# Altium schematic sheet FPGA_PWR.SchDoc
size A4; SheetNumber: 3; SheetTotal: 5
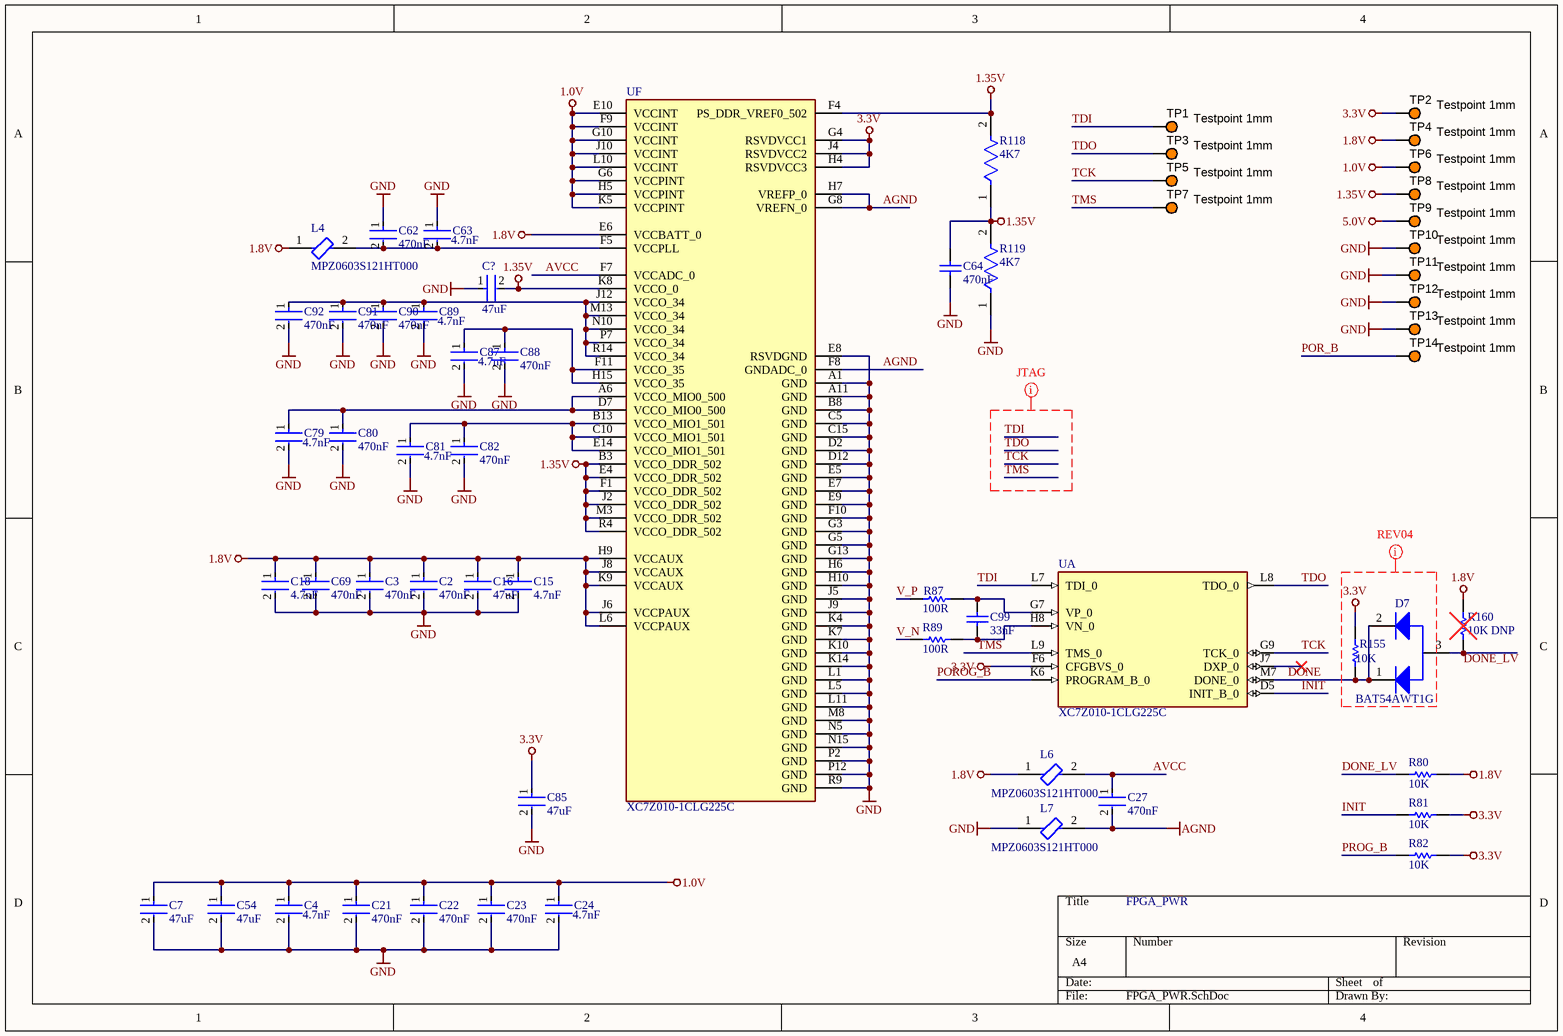
[diagram p0: FPGA_PWR.SchDoc]

## Parts
C2  470nF  [FP-0402-L_1_0_0_05-W_0_5-MFG]
C3  470nF  [FP-0402-L_1_0_0_05-W_0_5-MFG]
C4  4.7nF  [FP-CC0603-DA-MFG]
C7  47uF  [FP-GRM219-0_2-0_1-IPC_A]
C15  4.7nF  [FP-CC0603-DA-MFG]
C16  47uF  [FP-GRM219-0_2-0_1-IPC_A]
C18  4.7nF  [FP-CC0603-DA-MFG]
C21  470nF  [FP-0402-L_1_0_0_05-W_0_5-MFG]
C22  470nF  [FP-0402-L_1_0_0_05-W_0_5-MFG]
C23  470nF  [FP-0402-L_1_0_0_05-W_0_5-MFG]
C24  4.7nF  [FP-CC0603-DA-MFG]
C27  470nF  [FP-0402-L_1_0_0_05-W_0_5-MFG]
C54  47uF  [FP-GRM219-0_2-0_1-IPC_A]
C62  470nF  [FP-0402-L_1_0_0_05-W_0_5-MFG]
C63  4.7nF  [FP-CC0603-DA-MFG]
C64  470nF  [CAPC1005X56X25LL10T15]
C69  470nF  [FP-0402-L_1_0_0_05-W_0_5-MFG]
C79  4.7nF  [FP-CC0603-DA-MFG]
C80  470nF  [FP-0402-L_1_0_0_05-W_0_5-MFG]
C81  4.7nF  [FP-CC0603-DA-MFG]
C82  470nF  [FP-0402-L_1_0_0_05-W_0_5-MFG]
C85  47uF  [FP-GRM219-0_2-0_1-IPC_A]
C87  4.7nF  [FP-CC0603-DA-MFG]
C88  470nF  [FP-0402-L_1_0_0_05-W_0_5-MFG]
C89  4.7nF  [FP-CC0603-DA-MFG]
C90  470nF  [FP-0402-L_1_0_0_05-W_0_5-MFG]
C91  470nF  [FP-0402-L_1_0_0_05-W_0_5-MFG]
C92  470nF  [FP-0402-L_1_0_0_05-W_0_5-MFG]
C99  33nF  [CAPC1608X92X38LL15T08]
C?  47uF  [FP-GRM219-0_2-0_1-IPC_A]
D7  BAT54AWT1G  [ONSC-SOT-323-3-419-04_V]
L4  MPZ0603S121HT000  [FP-MPZ0603-IPC_C]
L6  MPZ0603S121HT000  [FP-MPZ0603-IPC_C]
L7  MPZ0603S121HT000  [FP-MPZ0603-IPC_C]
R80  10K  [RESC1005X40X25LL10T10]
R81  10K  [RESC1005X40X25LL10T10]
R82  10K  [RESC1005X40X25LL10T10]
R87  100R  [RESC0603X28X15LL05T05]
R89  100R  [RESC0603X28X15LL05T05]
R118  4K7  [FP-AC0402-MFG]
R119  4K7  [FP-AC0402-MFG]
R155  10K  [RESC1005X40X25LL10T10]
R160  10K DNP  [RESC1005X40X25LL10T10]
TP1  Testpoint 1mm  [KSTN-5003]
TP2  Testpoint 1mm  [KSTN-5003]
TP3  Testpoint 1mm  [KSTN-5003]
TP4  Testpoint 1mm  [KSTN-5003]
TP5  Testpoint 1mm  [KSTN-5003]
TP6  Testpoint 1mm  [KSTN-5003]
TP7  Testpoint 1mm  [KSTN-5003]
TP8  Testpoint 1mm  [KSTN-5003]
TP9  Testpoint 1mm  [KSTN-5003]
TP10  Testpoint 1mm  [KSTN-5003]
TP11  Testpoint 1mm  [KSTN-5003]
TP12  Testpoint 1mm  [KSTN-5003]
TP13  Testpoint 1mm  [KSTN-5003]
TP14  Testpoint 1mm  [KSTN-5003]
U  XC7Z010-1CLG225C  [BGA225C80P15X15_1300X1300X150]  (parts A,F of 6)

## Nets
1.0V: C4.1 C7.1 C21.1 C22.1 C23.1 C24.1 C54.1 TP6.1 U.E10(VCCINT) U.F9(VCCINT) U.G6(VCCPINT) U.G10(VCCINT) U.H5(VCCPINT) U.J10(VCCINT) U.K5(VCCPINT) U.L10(VCCINT)
1.8V: C2.1 C3.1 C15.1 C16.1 C18.1 C69.1 L4.1 L6.1 R80.2 R160.2 TP4.1 U.E6(VCCBATT_0) U.H9(VCCAUX) U.J6(VCCPAUX) U.J8(VCCAUX) U.K9(VCCAUX) U.L6(VCCPAUX)
1.35V: C64.2 C?.2 R118.1 R118.2 R119.2 TP8.1 U.B3(VCCO_DDR_502) U.E4(VCCO_DDR_502) U.F1(VCCO_DDR_502) U.F4(PS_DDR_VREF0_502) U.J2(VCCO_DDR_502) U.K8(VCCO_0) U.M3(VCCO_DDR_502) U.R4(VCCO_DDR_502)
3.3V: C85.1 R81.2 R82.2 R155.2 TP2.1 U.F6(CFGBVS_0) U.G4(RSVDVCC1) U.H4(RSVDVCC3) U.J4(RSVDVCC2)
5.0V: TP9.1
AGND: C27.2 L7.2 U.F8(GNDADC_0) U.G8(VREFN_0) U.H7(VREFP_0)
GND: C2.2 C3.2 C4.2 C7.2 C15.2 C16.2 C18.2 C21.2 C22.2 C23.2 C24.2 C54.2 C62.1 C63.1 C64.1 C69.2 C79.2 C80.2 C81.2 C82.2 C85.2 C87.2 C88.2 C89.2 C90.2 C91.2 C92.2 C?.1 L7.1 R119.1 TP10.1 TP11.1 TP12.1 TP13.1 U.A1(GND) U.A11(GND) U.B8(GND) U.C5(GND) U.C15(GND) U.D2(GND) U.D12(GND) U.E5(GND) U.E7(GND) U.E8(RSVDGND) U.E9(GND) U.F10(GND) U.G3(GND) U.G5(GND) U.G13(GND) U.H6(GND) U.H10(GND) U.J5(GND) U.J9(GND) U.K4(GND) U.K7(GND) U.K10(GND) U.K14(GND) U.L1(GND) U.L5(GND) U.L11(GND) U.M8(GND) U.N5(GND) U.N15(GND) U.P2(GND) U.P12(GND) U.R9(GND)
AVCC: C27.1 L6.2 U.F7(VCCADC_0)
DONE: D7.1(K1) D7.2(K2) R155.1 U.M7(DONE_0)
DONE_LV: R80.1
INIT: R81.1 U.D5(INIT_B_0)
POR_B: TP14.1
POROG_B: U.K6(PROGRAM_B_0)
PROG_B: R82.1
TCK: TP5.1 U.G9(TCK_0)
TDI: TP1.1 U.L7(TDI_0)
TDO: TP3.1 U.L8(TDO_0)
TMS: TP7.1 U.L9(TMS_0)
V_N: R89.1
V_P: R87.1
NetC62_2: C62.2 C63.2 L4.2 U.F5(VCCPLL)
NetC79_1: C79.1 C80.1 U.A6(VCCO_MIO0_500) U.D7(VCCO_MIO0_500)
NetC81_1: C81.1 C82.1 U.B13(VCCO_MIO1_501) U.C10(VCCO_MIO1_501) U.E14(VCCO_MIO1_501)
NetC87_1: C87.1 C88.1 U.F11(VCCO_35) U.H15(VCCO_35)
NetC89_1: C89.1 C90.1 C91.1 C92.1 U.J12(VCCO_34) U.M13(VCCO_34) U.N10(VCCO_34) U.P7(VCCO_34) U.R14(VCCO_34)
NetC99_1: C99.1 R89.2 U.H8(VN_0)
NetC99_2: C99.2 R87.2 U.G7(VP_0)
NetD7_3: D7.3(A) R160.1

Not connected (* = marked no-connect by the designer): U J7(DXP_0)*

## Layout directives
mark named REV04: 3.3V
mark named JTAG: TCK, TDI, TDO, TMS

## Notes on the sheet
- FPGA_PWR
- Labels drawn without touching a wire or pin: DONE_LV

## Library data of the parts
C2 C3 C21-C23 C27 C62 C69 C80 C82 C88 C90-C92 = CMP-14477-002186-2: None; Tolerance: 20%; Voltage Rating: 6.3V; Capacitance: 470nF; Case Code (Imperial): 0402; Mount: Surface Mount; Packaging: Tape and Reel; Width: 0.02inch; Case Code (Metric): 1005; Case/Package: 0402; RoHS Compliant: Yes; Length: 0.039inch; Thickness: 0.008inch; Max Operating Temperature: 85°C; Min Operating Temperature: -55°C
C4 C15 C18 C24 C63 C79 C81 C87 C89 = CMP-1035-02782-2: CAP CER 4.7UF 6.3V X5R 0603; Manufacturer: YAGEO; Manufacturer Part Number: CC0603MRX5R5BB475; Tolerance: 0.2; Temperature Coefficient: 15%; Material: Ceramic; Voltage Rating: 6.3 V; Package: CC0603-DA; Voltage: 6.3 V; Temperature Characteristic: X5R; Automotive: No; Temperature: -55°C to +125°C; Temperature Range Low: -55°C; Value: 4.7 uF; Temperature Range High: +125°C; Digikey Description: CAP CER 4.7UF 6.3V X5R 0603; Mouser Description: Multilayer Ceramic Capacitors MLCC - SMD/SMT 4.7uF 6.3V X5R 20%; Device Class L2: Capacitors; Lead Free: Yes; Footprint Url: http://www.yageo.com/exep/pages/download/literatures/UPY-C_GEN_24.pdf; ComponentLink2URL: http://www.yageo.com/documents/recent/UPY-GPHC_X7R_6.3V-to-50V_18.pdf; Height: 0.9mm; Device Class L3: Ceramic Capacitors; ComponentLink2Description: Datasheet; RoHS: TRUE; Device Class L1: Passive Components; Octopart: https://octopart.com/cc0603mrx5r5bb475-yageo-8376541; Category: Cap; Capacitance: 4.7 uF
C7 C16 C54 C85 C? = CMP-06035-004086-1: Chip Multilayer Ceramic Capacitors for General Purpose, 0805, 47uF, X5R, 15%, 20%, 6.3V; Case Code (Metric): 2012; Voltage Rating: 6.3V; Case Code (Imperial): 0805; Max Operating Temperature: 85°C; Width: 0.049inch; Length: 0.079inch; Min Operating Temperature: -55°C; Mount: Surface Mount; Packaging: Tape and Reel; Case/Package: 0805; Thickness: 0.037inch; Capacitance: 47uF; Tolerance: 20%
C64 = CMP-1034-02103-2: Manufacturer: AVX Interconnect / Elco; Part Number: 04026D474KAT2A
C99 = CMP-2006-01351-1: Manufacturer: Vitramon; Part Number: VJ0603Y333JXAAC
D7 = CMP-1055-00555-1: Schottky Barrier Diodes, 3-Pin SOT-323, Pb-Free, Tape and Reel; Manufacturer: On Semiconductor; trr Max (ns): 5; IFSM Max (A): 0.6; Configuration: Common Anode; ComponentLink3URL: http://www.onsemi.com/pub_link/Collateral/419-04.PDF; ComponentLink2Description: Datasheet; ComponentLink2URL: http://www.onsemi.cn/pub_link/Collateral/BAT54AWT1-D.PDF; DatasheetVersion: Rev. 3; PackageVersion: Rev. N, 11/2008; ComponentLink3Description: Package Specification; ComponentLink1Description: Manufacturer URL; ComponentLink1URL: http://www.onsemi.com/; PartNumber: BAT54AWT1G; Packing: Tape and Reel; Mounting Technology: Surface Mount; PackageDescription: 3-Pin Small Outline Transistor, Body 2 x 1.25 mm, Pitch 0.65 mm; RoHS: TRUE; PackageReference: SOT-323-3-419-04
L4 L6 L7 = CMP-08257-000447-1: CHIP BEADS FOR GENERAL SIGNAL LI; Max Current Rating: 1A; DC Resistance (DCR): 130mR; Number of Lines: 1; Min Operating Temperature: -55°C; Mount: Surface Mount; Case Code (Imperial): 0201; Case Code (Metric): 0603; Max Operating Temperature: 125°C; RoHS Compliant: Yes; Packaging: Cut Tape; Case/Package: 0201
R80-R82 R155 R160 = CMP-2002-04584-1: Manufacturer: KOA Speer; Part Number: SG73P1ETTP1002F
R87 R89 = CMP-2004-00007-1: Part Number: CRCW0201100RJNED; Manufacturer: Vishay
R118 R119 = CMP-03412-009386-2: RES 4.7kΩ ±1% 0.063W 0402
TP1-TP14 = CMP-1672-00009-1: Test Point, Orange, 1-Pin THD, RoHS; Peak Reverse Current: 600 uA; Forward Current: 3 A; Max Surge Current: 80 A; Forward Voltage: 1.08 V; Max Operating Temperature: 150 degC; PackageReference: 5003; Pins: 2; ComponentLink2URL: http://keyelco.com/userAssets/file/M65p56.pdf; PackageDescription: 1-Pin Through Hole Device, Dia 2.54 mm; Weight: 0.01 lb; Diameter: 5.3 mm; Mount: Through Hole; Package Quantity: 500; Packaging: Bulk; Min Operating Temperature: -65 degC; ComponentLink1Description: Manufacturer URL; Height: 0.25 inch; ComponentLink1URL: http://www.keyelco.com/; ComponentLink2Description: Datasheet; Width: 0.25 inch; REACH SVHC: No SVHC; RoHSCompliant: true; Radiation Hardening: No; Length: 9.5 mm; DatasheetVersion: Jun-15
U = XC7Z010-1CLG225C: Dual ARMÂ® CortexÂ®-A9 MPCoreâ„¢ with CoreSightâ„¢ System On Chip _SOC_ IC ZynqÂ®-7000 Artixâ„¢-7 FPGA, 28K Logic Cells 667MHz 225-CSPBGA _13x13_; MF: Xilinx Inc.; Value: *; SnapEDA_Link: https://www.snapeda.com/parts/XC7Z010-1CLG225C/Xilinx%20Inc./view-part/45778/?ref=snap; Digi-Key_Part_Number: 122-1855-ND; Package: CSPBGA-225 Xilinx; Digi-Key_Purchase_URL: https://www.digikey.by/product-detail/en/xilinx-inc/XC7Z010-1CLG225C/122-1855-ND/3925788?utm_source=snapeda&utm_medium=aggregator&utm_campaign=symbol; MP: XC7Z010-1CLG225C